# EAGLE design v1.0 (EAGLE 5.11)
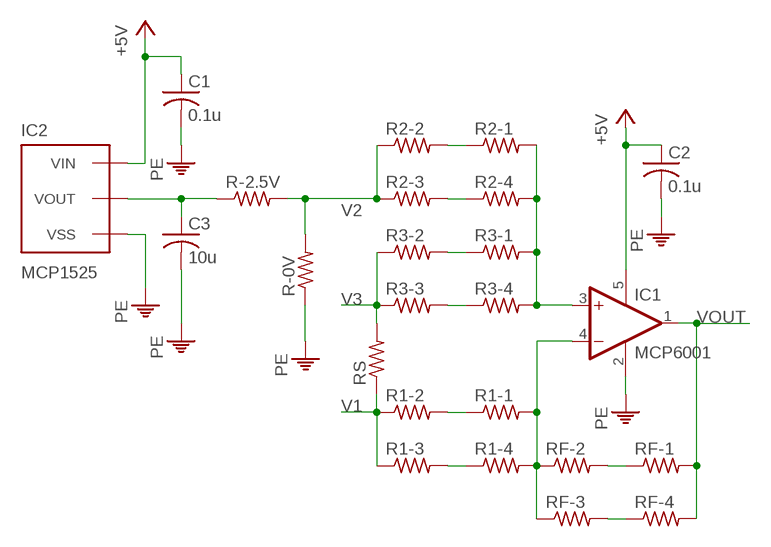
[diagram p0: schematic, sheet 1]

## Parts
C1  0.1u  C-USC0805  [C0805]
C2  0.1u  C-USC0805  [C0805]
C3  10u  C-USC0805  [C0805]
IC1  MCP6001  [SOT-23-5L]
IC2  MCP1525  [SOT23]
R1-1  R-US_R0805  [R0805]
R1-2  R-US_R0805  [R0805]
R1-3  R-US_R0805  [R0805]
R1-4  R-US_R0805  [R0805]
R2-1  R-US_R0805  [R0805]
R2-2  R-US_R0805  [R0805]
R2-3  R-US_R0805  [R0805]
R2-4  R-US_R0805  [R0805]
R3-1  R-US_R0805  [R0805]
R3-2  R-US_R0805  [R0805]
R3-3  R-US_R0805  [R0805]
R3-4  R-US_R0805  [R0805]
R-0V  R-US_R0805  [R0805]
R-2.5V  R-US_R0805  [R0805]
RF-1  R-US_R0805  [R0805]
RF-2  R-US_R0805  [R0805]
RF-3  R-US_R0805  [R0805]
RF-4  R-US_R0805  [R0805]
RS  R-US_R2512  [R2512]

## Nets
+5V: C1.1 C2.1 IC1.5(V+) IC2.1(VIN)
N$1: IC1.3(+IN) R2-1.2 R2-4.2 R3-1.2 R3-4.2
N$2: RF-1.1 RF-2.2
N$3: R1-1.1 R1-2.2
N$4: R2-1.1 R2-2.2
N$5: IC1.4(-IN) R1-1.2 R1-4.2 RF-2.1 RF-3.1
N$6: R3-1.1 R3-2.2
N$7: R3-3.2 R3-4.1
N$8: R2-3.2 R2-4.1
N$9: R1-3.2 R1-4.1
N$10: RF-3.2 RF-4.1
N$11: C3.1 IC2.2(VOUT) R-2.5V.1
PE: C1.2 C2.2 C3.2 IC1.2(V-) IC2.3(VSS) R-0V.1
V1: R1-2.1 R1-3.1 RS.1
V2: R2-2.1 R2-3.1 R-0V.2 R-2.5V.2
V3: R3-2.1 R3-3.1 RS.2
VOUT: IC1.1(OUT) RF-1.2 RF-4.2

## Library data of the parts
C1-C3 = rcl:C-US: CAPACITOR, American symbol
IC1 = Alan Rosenthal:MCP6001
IC2 = Alan Rosenthal:MCP1525
R1-1-R1-4 R2-1-R2-4 R3-1-R3-4 R-0V R-2.5V RF-1-RF-4 RS = rcl:R-US_: RESISTOR, American symbol

## Board
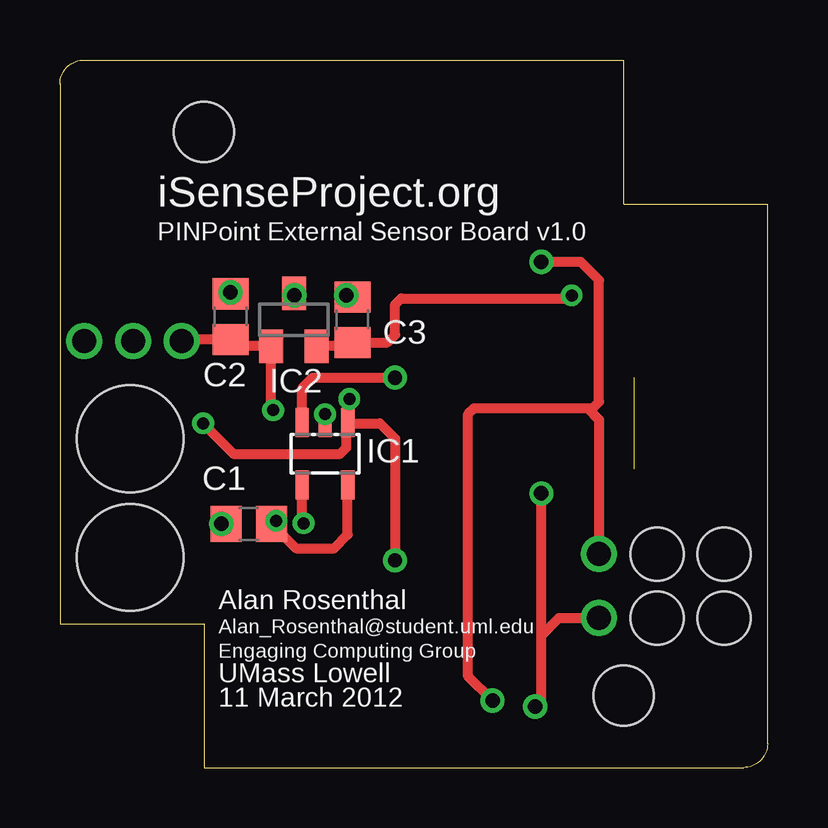
[diagram p1: board, top side]
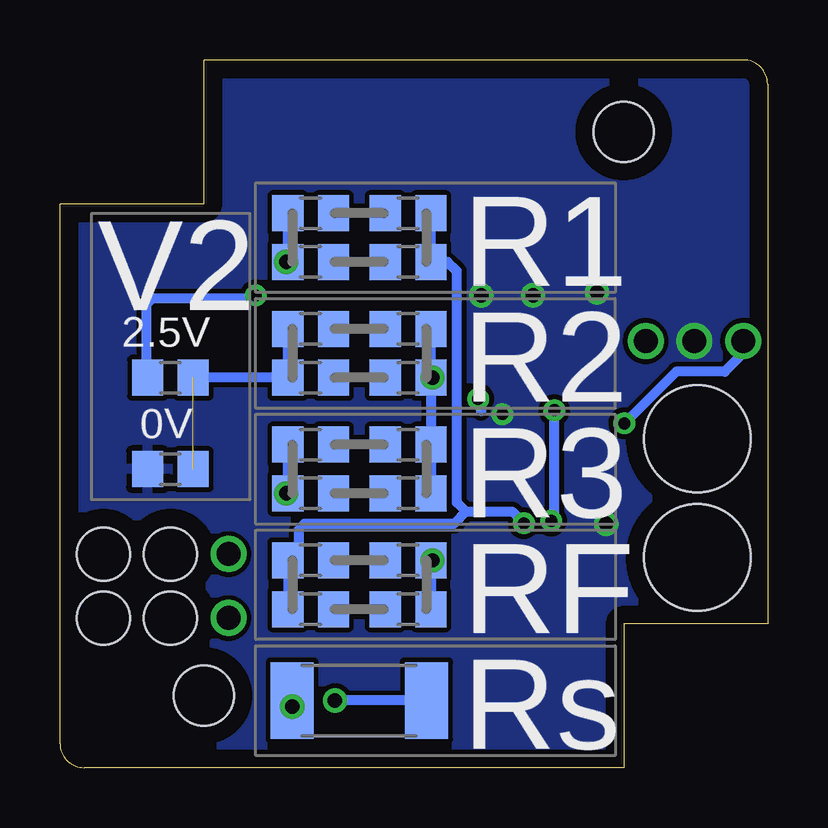
[diagram p2: board, bottom side, seen from below]

Size 29.5 x 29.5 mm. Coordinates in mm from the lower left corner, seen from the top.
Outline: 0,28.5 0,6 6,6 6,0 28.5,0 arc90 29.5,1 29.5,23.5 23.5,23.5 23.5,29.5 1,29.5 arc90 0,28.5
Copper layers (1*16): Top 0.035mm / dielectric 1.5mm / Bottom 0.035mm
Design rules "default *": minimum track width 10mil, minimum drill 6mm, track to track 8mil, track to pad 8mil, pad to pad 8mil, via to via 8mil, smd to smd 8mil, copper to edge 30mil, drill to drill 8mil, minimum pad ring 10mil, minimum via ring 8mil, stop-mask expansion 4mil, vias tented up to drill 0mil, thermal gap 10mil
Holes 2.5 mm at 6,26.5 23.5,3
Holes 4.45 mm at 2.92,8.76 2.92,13.71
Holes 2.22 mm at 24.89,6.23 24.89,8.9 27.69,8.9 27.69,6.23

### Footprints (pad centres in the part's own frame; a part is rotated, then mirrored left to right if it is on the bottom)
C0805 = smd 1.3 x 1.5: 1 -0.95,0; 2 0.95,0
SOT-23-5L = smd 0.55 x 1.2: 1 -2.22,-1.3; 2 -1.27,-1.3; 3 -0.32,-1.3; 4 -0.32,1.3; 5 -2.22,1.3
SOT23 = smd 1 x 1.4: 1 -0.85,-1.1; 2 1.05,-1.1; 3 0.1,1.1
R0805 = smd 1.3 x 1.5: 1 -0.95,0; 2 0.95,0
R2512 = smd 1.8 x 3.2: 1 -2.8,0; 2 2.8,0

### Placement (x,y rotation side)
C1  7.87,10.16 180 top
C2  7.11,18.8 90 top
C3  12.19,18.67 90 top
IC1  9.78,13.08 180 top
IC2  9.65,18.67 0 top
R1-1  14.99,23.11 0 bottom
R1-2  19.05,23.11 0 bottom
R1-3  19.05,21.08 0 bottom
R1-4  14.99,21.08 0 bottom
R2-1  14.99,18.29 0 bottom
R2-2  19.05,18.29 0 bottom
R2-3  19.05,16.26 0 bottom
R2-4  14.99,16.26 0 bottom
R3-1  14.99,13.46 0 bottom
R3-2  19.05,13.46 0 bottom
R3-3  19.05,11.43 0 bottom
R3-4  14.99,11.43 0 bottom
R-0V  24.89,12.45 0 bottom
R-2.5V  24.89,16.26 0 bottom
RF-1  14.99,8.64 0 bottom
RF-2  19.05,8.64 0 bottom
RF-3  19.05,6.6 0 bottom
RF-4  14.99,6.6 0 bottom
RS  17.02,2.79 180 bottom

### Tracks (layer width: path | path; a pad name or v marks a point on that pad's centre or on a via)
+5V  (via drill 0.5, 1)
  Top 0.406: C1.1 8.8,10.18 | IC1.5 12,9.71 11.43,9.14 9.84,9.14 C1.1 | v5.08,17.78 5.15,17.85 C2.1 7.39,17.57 IC2.1 8.8,14.99 v8.89,14.9 | C1.1 8.89,10.23 8.96,10.23 v9.02,10.29
  Bottom 0.406: v8.89,14.9 8.89,10.41 v9.02,10.29
N$1  (via drill 0.6)
  Top 0.406: IC1.3 10.1,15.81 10.54,16.26 v13.97,16.26
  Bottom 0.406: R2-4.2 R2-1.2 | R3-4.2 R3-1.2 R2-4.2 | v13.97,16.26 R2-4.2
N$2
  Bottom 0.406: RF-1.1 RF-2.2
N$3
  Bottom 0.406: R1-1.1 R1-2.2
N$4
  Bottom 0.406: R2-1.1 R2-2.2
N$5  (via drill 0.5)
  Top 0.406: IC1.4 10.06,11.78 10.06,10.28 v10.16,10.18
  Bottom 0.406: R1-1.2 R1-4.2 13.34,21.08 12.95,20.7 12.95,11.05 12.57,10.67 | RF-3.1 RF-2.1 19.56,9.08 19.56,9.91 19.3,10.16 13.08,10.16 12.57,10.67 | 12.57,10.67 10.64,10.67 v10.16,10.18
N$6
  Bottom 0.406: R3-1.1 R3-2.2
N$7
  Bottom 0.406: R3-4.1 R3-3.2
N$8
  Bottom 0.406: R2-4.1 R2-3.2
N$9
  Bottom 0.406: R1-4.1 R1-3.2
N$10
  Bottom 0.406: RF-4.1 RF-3.2
N$11  (via drill 0.5)
  Top 0.406: IC2.2 12.17,17.57 C3.1 13.65,17.72 13.97,18.03 13.97,19.3 14.22,19.56 21.21,19.56 v21.34,19.68
  Bottom 0.406: 25.91,16.83 R-2.5V.1 25.91,16.32 25.91,19.3 25.65,19.56 21.46,19.56 v21.34,19.68
PE  (via drill 0.5, 0.6, 1)
  Top 0.406: C2.2 v7.11,19.81 | IC2.3 9.62,19.91 v9.78,19.68 | C3.2 v11.94,19.68 | C1.2 v6.73,10.16 | IC1.2 v11.05,14.73
  other vias: 3.05,17.78
  pour Bottom: 0,29.46 29.46,29.46 29.46,0 0,0
V1  (via drill 0.6, 1)
  Top 0.406: v20.07,21.08 21.72,21.08 22.48,20.32 22.48,15.24 22.23,14.99 22,14.99 | v18.03,2.79 17.02,3.81 17.02,14.73 17.27,14.99 22,14.99 | v22.48,8.9 22.48,14.51 22,14.99
  Bottom 0.406: R1-2.1 R1-3.1 v20.07,21.08 | RS.1 v18.03,2.79
V2  (1 unrouted)
  Bottom 0.406: R2-2.1 R2-3.1 R-2.5V.2
V3  (via drill 0.6, 1)
  Top 0.406: 20.07,5.5 20.07,2.79 v19.81,2.54 | 20.07,5.5 v20.07,11.43 | v22.48,6.23 20.8,6.23 20.07,5.5
  Bottom 0.406: R3-2.1 R3-3.1 v20.07,11.43 | RS.2 v19.81,2.54 19.31,2.79
VOUT  (via drill 0.5, 0.6, 1)
  Top 0.406: v13.97,8.64 13.97,13.72 13.34,14.35 12.03,14.35 IC1.1 | IC1.1 12,14.92 v12.06,15.37 | v5.97,14.35 7.24,13.08 11.68,13.08 11.94,13.34 11.94,14.32 IC1.1
  Bottom 0.406: RF-4.2 RF-1.2 v13.97,8.64 | v1.02,17.78 1.02,17.27 1.78,16.51 3.81,16.51 v5.97,14.35 | v12.06,15.37 11.94,14.86

### Text on the board
tNames: iSenseProject.org | PINPoint External Sensor Board v1.0 | Alan Rosenthal | Alan_Rosenthal@student.uml.edu | Engaging Computing Group | UMass Lowell | 11 March 2012
bNames: R1 | V2 | 2.5V | R2 | 0V | R3 | RF | Rs
tDocu: Vout | GND | +5V | V1 | V3